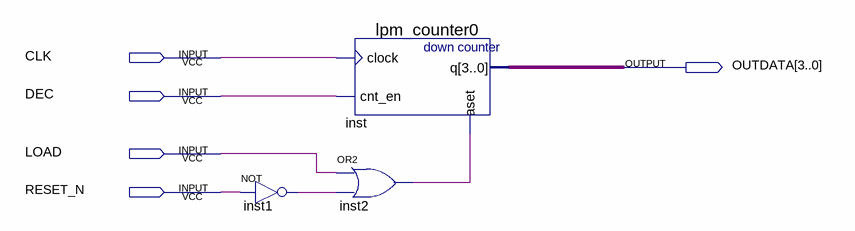
[diagram p0: schematic sheet]
// Quartus schematic wb_mul_dcnt4.bdf as structural Verilog: 3 symbols, 5 pins
module wb_mul_dcnt4 (
  input  CLK,
  input  DEC,
  input  LOAD,
  input  RESET_N,
  output [3:0] OUTDATA
);

  wire inst1_out, inst2_out;

  not inst1 (inst1_out, RESET_N);
  lpm_counter0 inst (.clock(CLK), .cnt_en(DEC), .aset(inst2_out), .q(OUTDATA));
  or inst2 (inst2_out, LOAD, inst1_out);
endmodule
